# Altium schematic sheet stm32h750xbh6-sig.SchDoc: MCUB
size A4; Date: 10.4.2025; CheckedBy: BCY; DrawnBy: miaow; DocumentNumber: 7; Revision: v0.0.1; SheetNumber: 7; SheetTotal: 12; Sample: A0; Url: github.com/miaow-cn/pcb-lib; Liscense: GPLv3; Board: MIAOW FOC BOARD; BoardType: MAIN_PCB; Desc: io part of stm32h750xbh6
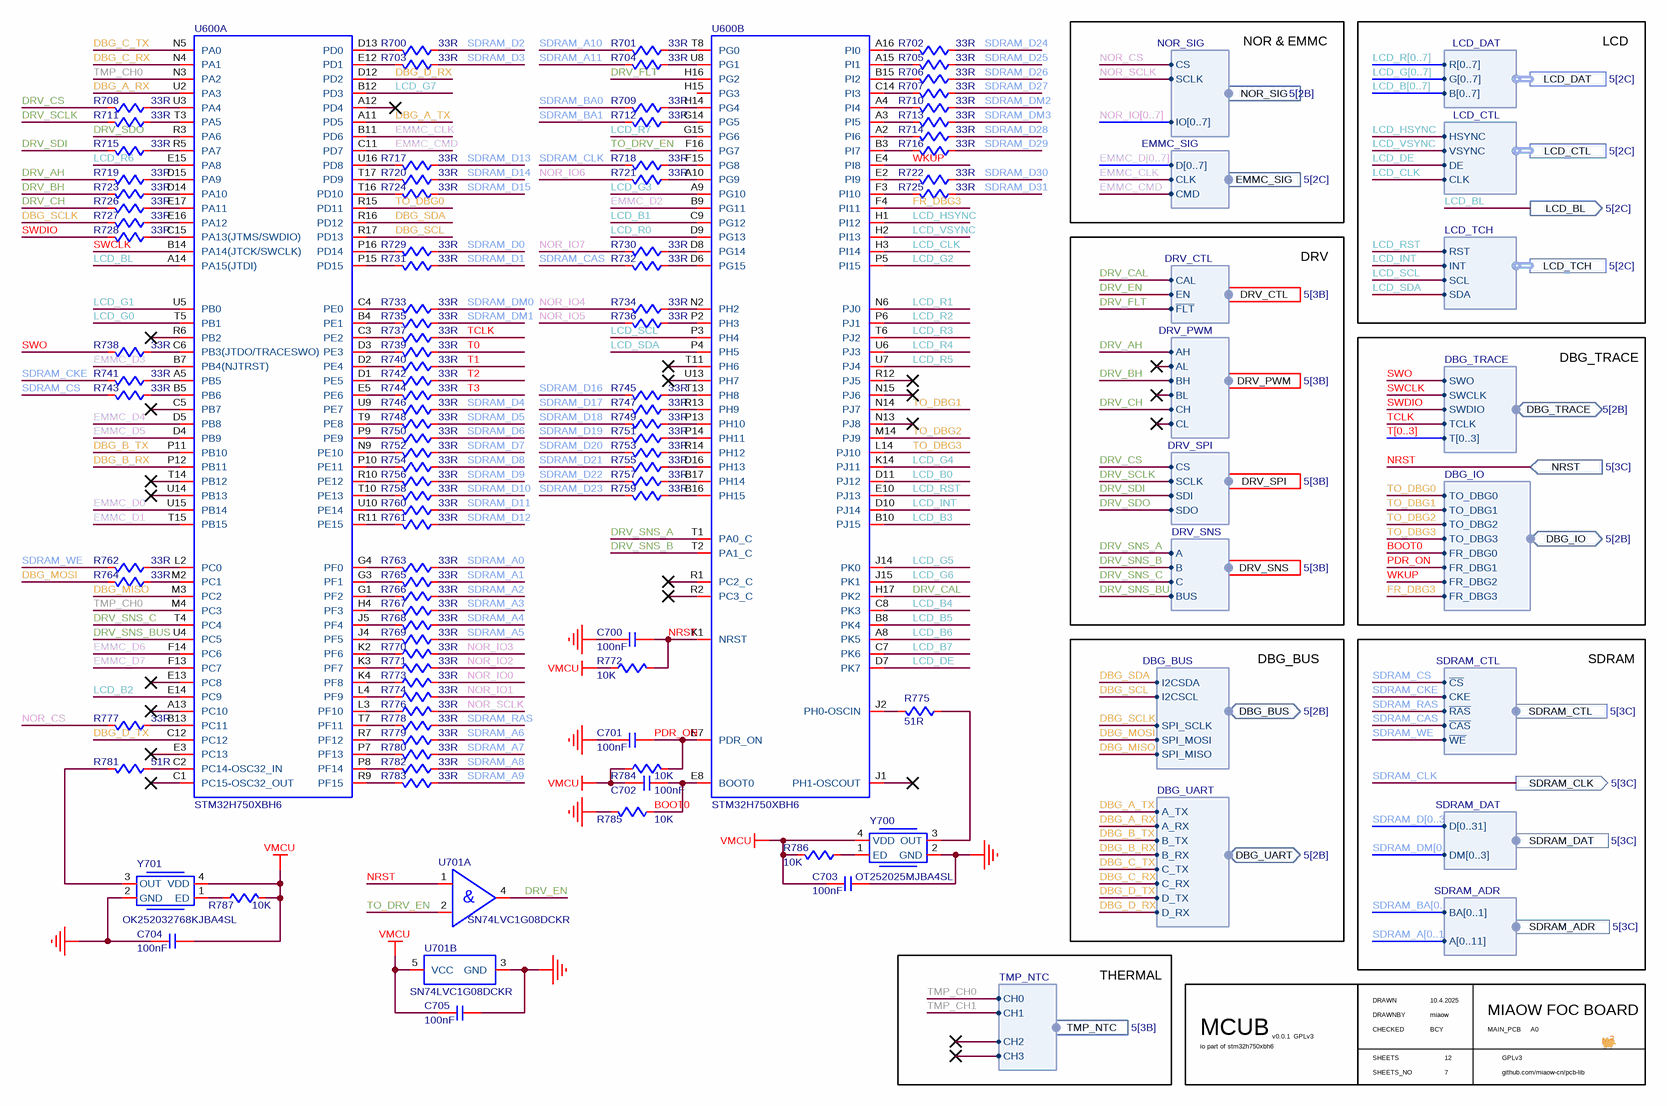
[diagram p0: stm32h750xbh6-sig.SchDoc]

## Parts
C700  value 100nF  [C0402]  (hidden comment: C-NOMO)
C701  value 100nF  [C0402]  (hidden comment: C-NOMO)
C702  value 100nF  [C0402]  (hidden comment: C-NOMO)
C703  value 100nF  [C0402]  (hidden comment: C-NOMO)
C704  value 100nF  [C0402]  (hidden comment: C-NOMO)
C705  value 100nF  [C0402]  (hidden comment: C-NOMO)
R700  value 33R  [R0402]  (hidden comment: R)
R701  value 33R  [R0402]  (hidden comment: R)
R702  value 33R  [R0402]  (hidden comment: R)
R703  value 33R  [R0402]  (hidden comment: R)
R704  value 33R  [R0402]  (hidden comment: R)
R705  value 33R  [R0402]  (hidden comment: R)
R706  value 33R  [R0402]  (hidden comment: R)
R707  value 33R  [R0402]  (hidden comment: R)
R708  value 33R  [R0402]  (hidden comment: R)
R709  value 33R  [R0402]  (hidden comment: R)
R710  value 33R  [R0402]  (hidden comment: R)
R711  value 33R  [R0402]  (hidden comment: R)
R712  value 33R  [R0402]  (hidden comment: R)
R713  value 33R  [R0402]  (hidden comment: R)
R714  value 33R  [R0402]  (hidden comment: R)
R715  value 33R  [R0402]  (hidden comment: R)
R716  value 33R  [R0402]  (hidden comment: R)
R717  value 33R  [R0402]  (hidden comment: R)
R718  value 33R  [R0402]  (hidden comment: R)
R719  value 33R  [R0402]  (hidden comment: R)
R720  value 33R  [R0402]  (hidden comment: R)
R721  value 33R  [R0402]  (hidden comment: R)
R722  value 33R  [R0402]  (hidden comment: R)
R723  value 33R  [R0402]  (hidden comment: R)
R724  value 33R  [R0402]  (hidden comment: R)
R725  value 33R  [R0402]  (hidden comment: R)
R726  value 33R  [R0402]  (hidden comment: R)
R727  value 33R  [R0402]  (hidden comment: R)
R728  value 33R  [R0402]  (hidden comment: R)
R729  value 33R  [R0402]  (hidden comment: R)
R730  value 33R  [R0402]  (hidden comment: R)
R731  value 33R  [R0402]  (hidden comment: R)
R732  value 33R  [R0402]  (hidden comment: R)
R733  value 33R  [R0402]  (hidden comment: R)
R734  value 33R  [R0402]  (hidden comment: R)
R735  value 33R  [R0402]  (hidden comment: R)
R736  value 33R  [R0402]  (hidden comment: R)
R737  value 33R  [R0402]  (hidden comment: R)
R738  value 33R  [R0402]  (hidden comment: R)
R739  value 33R  [R0402]  (hidden comment: R)
R740  value 33R  [R0402]  (hidden comment: R)
R741  value 33R  [R0402]  (hidden comment: R)
R742  value 33R  [R0402]  (hidden comment: R)
R743  value 33R  [R0402]  (hidden comment: R)
R744  value 33R  [R0402]  (hidden comment: R)
R745  value 33R  [R0402]  (hidden comment: R)
R746  value 33R  [R0402]  (hidden comment: R)
R747  value 33R  [R0402]  (hidden comment: R)
R748  value 33R  [R0402]  (hidden comment: R)
R749  value 33R  [R0402]  (hidden comment: R)
R750  value 33R  [R0402]  (hidden comment: R)
R751  value 33R  [R0402]  (hidden comment: R)
R752  value 33R  [R0402]  (hidden comment: R)
R753  value 33R  [R0402]  (hidden comment: R)
R754  value 33R  [R0402]  (hidden comment: R)
R755  value 33R  [R0402]  (hidden comment: R)
R756  value 33R  [R0402]  (hidden comment: R)
R757  value 33R  [R0402]  (hidden comment: R)
R758  value 33R  [R0402]  (hidden comment: R)
R759  value 33R  [R0402]  (hidden comment: R)
R760  value 33R  [R0402]  (hidden comment: R)
R761  value 33R  [R0402]  (hidden comment: R)
R762  value 33R  [R0402]  (hidden comment: R)
R763  value 33R  [R0402]  (hidden comment: R)
R764  value 33R  [R0402]  (hidden comment: R)
R765  value 33R  [R0402]  (hidden comment: R)
R766  value 33R  [R0402]  (hidden comment: R)
R767  value 33R  [R0402]  (hidden comment: R)
R768  value 33R  [R0402]  (hidden comment: R)
R769  value 33R  [R0402]  (hidden comment: R)
R770  value 33R  [R0402]  (hidden comment: R)
R771  value 33R  [R0402]  (hidden comment: R)
R772  value 10K  [R0402]  (hidden comment: R)
R773  value 33R  [R0402]  (hidden comment: R)
R774  value 33R  [R0402]  (hidden comment: R)
R775  value 51R  [R0402]  (hidden comment: R)
R776  value 33R  [R0402]  (hidden comment: R)
R777  value 33R  [R0402]  (hidden comment: R)
R778  value 33R  [R0402]  (hidden comment: R)
R779  value 33R  [R0402]  (hidden comment: R)
R780  value 33R  [R0402]  (hidden comment: R)
R781  value 51R  [R0402]  (hidden comment: R)
R782  value 33R  [R0402]  (hidden comment: R)
R783  value 33R  [R0402]  (hidden comment: R)
R784  value 10K  [R0402]  (hidden comment: R)
R785  value 10K  [R0402]  (hidden comment: R)
R786  value 10K  [R0402]  (hidden comment: R)
R787  value 10K  [R0402]  (hidden comment: R)
U600  STM32H750XBH6  [STM32H750XBH6]  (parts A,B of 3)
U701  SN74LVC1G08DCKR  [SN74LVC1G08DCKR]  (parts A,B of 2)
Y700  OT252025MJBA4SL  [OT252025MJBA4SL]
Y701  OK252032768KJBA4SL  [OK252032768KJBA4SL]

## Ports
DBG_BUS (bidir, harness DBG_BUS, see 5[2B]), DBG_IO (bidir, harness DBG_IO, see 5[2B]), DBG_TRACE (bidir, harness DBG_TRACE, see 5[2B]), DBG_UART (bidir, harness DBG_UART, see 5[2B]), DRV_CTL (out, harness DRV_CTL, see 5[3B]), DRV_PWM (out, harness DRV_PWM, see 5[3B]), DRV_SNS (out, harness DRV_SNS, see 5[3B]), DRV_SPI (out, harness DRV_SPI, see 5[3B]), EMMC_SIG (in, harness EMMC_SIG, see 5[2C]), LCD_BL (out, see 5[2C]), LCD_CTL (harness LCD_CTL, see 5[2C]), LCD_DAT (harness LCD_DAT, see 5[2C]), LCD_TCH (harness LCD_TCH, see 5[2C]), NOR_SIG (in, harness NOR_SIG, see 5[2B]), NRST (in, see 5[3C]), SDRAM_ADR (harness SDRAM_ADR, see 5[3C]), SDRAM_CLK (out, see 5[3C]), SDRAM_CTL (harness SDRAM_CTL, see 5[3C]), SDRAM_DAT (harness SDRAM_DAT, see 5[3C]), TMP_NTC (in, harness TMP_NTC, see 5[3B])

## Harnesses
SDRAM_DAT: DM[0..3], D[0..31]
SDRAM_ADR: BA[0..1], A[0..11]
SDRAM_CTL: ~{CS}, CKE, ~{RAS}, ~{CAS}, ~{WE}
DRV_CTL: CAL, EN, ~{FLT}
DRV_SNS: C, B, A, BUS
DRV_SPI: CS, SCLK, SDI, SDO
DRV_PWM: AH, AL, BH, BL, CH, CL
LCD_DAT: R[0..7], G[0..7], B[0..7]
LCD_CTL: HSYNC, VSYNC, DE, CLK
LCD_TCH: SDA, SCL, INT, RST
EMMC_SIG: D[0..7], CLK, CMD
NOR_SIG: CS, SCLK, IO[0..7]
DBG_UART: A_TX, A_RX, B_TX, B_RX, C_TX, C_RX, D_TX, D_RX
DBG_BUS: I2CSDA, I2CSCL, SPI_MISO, SPI_MOSI, SPI_SCLK
DBG_TRACE: SWO, SWCLK, SWDIO, TCLK, T[0..3]
DBG_IO: TO_DBG0, TO_DBG1, FR_DBG0, TO_DBG3, TO_DBG2, FR_DBG1, FR_DBG2, FR_DBG3
TMP_NTC: CH0, CH1, CH2, CH3

## Nets
GND: C700.2 C701.2 C703.2 C704.2 C705.2 R785.1 U701.3(GND) Y700.2(GND) Y701.2(GND)
VMCU: C702.2 C703.1 C704.1 C705.1 R772.1 R784.2 R786.1 R787.1 U701.5(VCC) Y700.4(VDD) Y701.4(VDD)
BOOT0: C702.1 R785.2 U600.E8(BOOT0) ; port DBG_IO.FR_DBG0
DBG_A_RX: U600.U2(PA3) ; port DBG_UART.A_RX
DBG_A_TX: U600.A11(PD5) ; port DBG_UART.A_TX
DBG_B_RX: U600.P12(PB11) ; port DBG_UART.B_RX
DBG_B_TX: U600.P11(PB10) ; port DBG_UART.B_TX
DBG_C_RX: U600.N4(PA1) ; port DBG_UART.C_RX
DBG_C_TX: U600.N5(PA0) ; port DBG_UART.C_TX
DBG_D_RX: U600.D12(PD2) ; port DBG_UART.D_RX
DBG_D_TX: U600.C12(PC12) ; port DBG_UART.D_TX
DBG_MISO: U600.M3(PC2) ; port DBG_BUS.SPI_MISO
DBG_MOSI: R764.2 ; port DBG_BUS.SPI_MOSI
DBG_SCL: U600.R17(PD13) ; port DBG_BUS.I2CSCL
DBG_SCLK: R727.2 ; port DBG_BUS.SPI_SCLK
DBG_SDA: U600.R16(PD12) ; port DBG_BUS.I2CSDA
DRV_AH: R719.2 ; port DRV_PWM.AH
DRV_BH: R723.2 ; port DRV_PWM.BH
DRV_CAL: U600.H17(PK2) ; port DRV_CTL.CAL
DRV_CH: R726.2 ; port DRV_PWM.CH
DRV_CS: R708.2 ; port DRV_SPI.CS
DRV_EN: U701.4(Y) ; port DRV_CTL.EN
DRV_FLT: U600.H16(PG2) ; port DRV_CTL.~{FLT}
DRV_SCLK: R711.2 ; port DRV_SPI.SCLK
DRV_SDI: R715.2 ; port DRV_SPI.SDI
DRV_SDO: U600.R3(PA6) ; port DRV_SPI.SDO
DRV_SNS_A: U600.T1(PA0_C) ; port DRV_SNS.A
DRV_SNS_B: U600.T2(PA1_C) ; port DRV_SNS.B
DRV_SNS_BUS: U600.U4(PC5) ; port DRV_SNS.BUS
DRV_SNS_C: U600.T4(PC4) ; port DRV_SNS.C
EMMC_CLK: U600.B11(PD6) ; port EMMC_SIG.CLK
EMMC_CMD: U600.C11(PD7) ; port EMMC_SIG.CMD
EMMC_D0: U600.U15(PB14)
EMMC_D1: U600.T15(PB15)
EMMC_D2: U600.B9(PG11)
EMMC_D3: U600.B7(PB4(NJTRST))
EMMC_D4: U600.D5(PB8)
EMMC_D5: U600.D4(PB9)
EMMC_D6: U600.F14(PC6)
EMMC_D7: U600.F13(PC7)
FR_DBG3: U600.F4(PI11) ; port DBG_IO.FR_DBG3
LCD_B0: U600.D11(PJ12)
LCD_B1: U600.C9(PG12)
LCD_B2: U600.E14(PC9)
LCD_B3: U600.B10(PJ15)
LCD_B4: U600.C8(PK3)
LCD_B5: U600.B8(PK4)
LCD_B6: U600.A8(PK5)
LCD_B7: U600.C7(PK6)
LCD_BL: U600.A14(PA15(JTDI)) ; port LCD_BL
LCD_CLK: U600.H3(PI14) ; port LCD_CTL.CLK
LCD_DE: U600.D7(PK7) ; port LCD_CTL.DE
LCD_G0: U600.T5(PB1)
LCD_G1: U600.U5(PB0)
LCD_G2: U600.P5(PI15)
LCD_G3: U600.A9(PG10)
LCD_G4: U600.K14(PJ11)
LCD_G5: U600.J14(PK0)
LCD_G6: U600.J15(PK1)
LCD_G7: U600.B12(PD3)
LCD_HSYNC: U600.H1(PI12) ; port LCD_CTL.HSYNC
LCD_INT: U600.D10(PJ14) ; port LCD_TCH.INT
LCD_R0: U600.D9(PG13)
LCD_R1: U600.N6(PJ0)
LCD_R2: U600.P6(PJ1)
LCD_R3: U600.T6(PJ2)
LCD_R4: U600.U6(PJ3)
LCD_R5: U600.U7(PJ4)
LCD_R6: U600.E15(PA8)
LCD_R7: U600.G15(PG6)
LCD_RST: U600.E10(PJ13) ; port LCD_TCH.RST
LCD_SCL: U600.P3(PH4) ; port LCD_TCH.SCL
LCD_SDA: U600.P4(PH5) ; port LCD_TCH.SDA
LCD_VSYNC: U600.H2(PI13) ; port LCD_CTL.VSYNC
NOR_CS: R777.2 ; port NOR_SIG.CS
NOR_IO0: R773.2
NOR_IO1: R774.2
NOR_IO2: R771.2
NOR_IO3: R770.2
NOR_IO4: R734.2
NOR_IO5: R736.2
NOR_IO6: R721.2
NOR_IO7: R730.2
NOR_SCLK: R776.2 ; port NOR_SIG.SCLK
NRST: C700.1 R772.2 U600.K1(NRST) U701.1(A) ; port NRST
PDR_ON: C701.1 R784.1 U600.E7(PDR_ON) ; port DBG_IO.FR_DBG1
SDRAM_A0: R763.2
SDRAM_A1: R765.2
SDRAM_A2: R766.2
SDRAM_A3: R767.2
SDRAM_A4: R768.2
SDRAM_A5: R769.2
SDRAM_A6: R779.2
SDRAM_A7: R780.2
SDRAM_A8: R782.2
SDRAM_A9: R783.2
SDRAM_A10: R701.2
SDRAM_A11: R704.2
SDRAM_BA0: R709.2
SDRAM_BA1: R712.2
SDRAM_CAS: R732.2 ; port SDRAM_CTL.~{CAS}
SDRAM_CKE: R741.2 ; port SDRAM_CTL.CKE
SDRAM_CLK: R718.2 ; port SDRAM_CLK
SDRAM_CS: R743.2 ; port SDRAM_CTL.~{CS}
SDRAM_D0: R729.2
SDRAM_D1: R731.2
SDRAM_D2: R700.2
SDRAM_D3: R703.2
SDRAM_D4: R746.2
SDRAM_D5: R748.2
SDRAM_D6: R750.2
SDRAM_D7: R752.2
SDRAM_D8: R754.2
SDRAM_D9: R756.2
SDRAM_D10: R758.2
SDRAM_D11: R760.2
SDRAM_D12: R761.2
SDRAM_D13: R717.2
SDRAM_D14: R720.2
SDRAM_D15: R724.2
SDRAM_D16: R745.2
SDRAM_D17: R747.2
SDRAM_D18: R749.2
SDRAM_D19: R751.2
SDRAM_D20: R753.2
SDRAM_D21: R755.2
SDRAM_D22: R757.2
SDRAM_D23: R759.2
SDRAM_D24: R702.2
SDRAM_D25: R705.2
SDRAM_D26: R706.2
SDRAM_D27: R707.2
SDRAM_D28: R714.2
SDRAM_D29: R716.2
SDRAM_D30: R722.2
SDRAM_D31: R725.2
SDRAM_DM0: R733.2
SDRAM_DM1: R735.2
SDRAM_DM2: R710.2
SDRAM_DM3: R713.2
SDRAM_RAS: R778.2 ; port SDRAM_CTL.~{RAS}
SDRAM_WE: R762.2 ; port SDRAM_CTL.~{WE}
SWCLK: U600.B14(PA14(JTCK/SWCLK)) ; port DBG_TRACE.SWCLK
SWDIO: R728.2 ; port DBG_TRACE.SWDIO
SWO: R738.2 ; port DBG_TRACE.SWO
T0: R739.2
T1: R740.2
T2: R742.2
T3: R744.2
TCLK: R737.2 ; port DBG_TRACE.TCLK
TMP_CH0: U600.M4(PC3) U600.N3(PA2) ; port TMP_NTC.CH0
TMP_CH1: port TMP_NTC.CH1
TO_DBG0: U600.R15(PD11) ; port DBG_IO.TO_DBG0
TO_DBG1: U600.N14(PJ7) ; port DBG_IO.TO_DBG1
TO_DBG2: U600.M14(PJ9) ; port DBG_IO.TO_DBG2
TO_DBG3: U600.L14(PJ10) ; port DBG_IO.TO_DBG3
TO_DRV_EN: U600.F16(PG7) U701.2(B)
WKUP: U600.E4(PI8) ; port DBG_IO.FR_DBG2
NetR700_1: R700.1 U600.D13(PD0)
NetR701_1: R701.1 U600.T8(PG0)
NetR702_1: R702.1 U600.A16(PI0)
NetR703_1: R703.1 U600.E12(PD1)
NetR704_1: R704.1 U600.U8(PG1)
NetR705_1: R705.1 U600.A15(PI1)
NetR706_1: R706.1 U600.B15(PI2)
NetR707_1: R707.1 U600.C14(PI3)
NetR708_1: R708.1 U600.U3(PA4)
NetR709_1: R709.1 U600.H14(PG4)
NetR710_1: R710.1 U600.A4(PI4)
NetR711_1: R711.1 U600.T3(PA5)
NetR712_1: R712.1 U600.G14(PG5)
NetR713_1: R713.1 U600.A3(PI5)
NetR714_1: R714.1 U600.A2(PI6)
NetR715_1: R715.1 U600.R5(PA7)
NetR716_1: R716.1 U600.B3(PI7)
NetR717_1: R717.1 U600.U16(PD8)
NetR718_1: R718.1 U600.F15(PG8)
NetR719_1: R719.1 U600.D15(PA9)
NetR720_1: R720.1 U600.T17(PD9)
NetR721_1: R721.1 U600.A10(PG9)
NetR722_1: R722.1 U600.E2(PI9)
NetR723_1: R723.1 U600.D14(PA10)
NetR724_1: R724.1 U600.T16(PD10)
NetR725_1: R725.1 U600.F3(PI10)
NetR726_1: R726.1 U600.E17(PA11)
NetR727_1: R727.1 U600.E16(PA12)
NetR728_1: R728.1 U600.C15(PA13(JTMS/SWDIO))
NetR729_1: R729.1 U600.P16(PD14)
NetR730_1: R730.1 U600.D8(PG14)
NetR731_1: R731.1 U600.P15(PD15)
NetR732_1: R732.1 U600.D6(PG15)
NetR733_1: R733.1 U600.C4(PE0)
NetR734_1: R734.1 U600.N2(PH2)
NetR735_1: R735.1 U600.B4(PE1)
NetR736_1: R736.1 U600.P2(PH3)
NetR737_1: R737.1 U600.C3(PE2)
NetR738_1: R738.1 U600.C6(PB3(JTDO/TRACESWO))
NetR739_1: R739.1 U600.D3(PE3)
NetR740_1: R740.1 U600.D2(PE4)
NetR741_1: R741.1 U600.A5(PB5)
NetR742_1: R742.1 U600.D1(PE5)
NetR743_1: R743.1 U600.B5(PB6)
NetR744_1: R744.1 U600.E5(PE6)
NetR745_1: R745.1 U600.T13(PH8)
NetR746_1: R746.1 U600.U9(PE7)
NetR747_1: R747.1 U600.R13(PH9)
NetR748_1: R748.1 U600.T9(PE8)
NetR749_1: R749.1 U600.P13(PH10)
NetR750_1: R750.1 U600.P9(PE9)
NetR751_1: R751.1 U600.P14(PH11)
NetR752_1: R752.1 U600.N9(PE10)
NetR753_1: R753.1 U600.R14(PH12)
NetR754_1: R754.1 U600.P10(PE11)
NetR755_1: R755.1 U600.D16(PH13)
NetR756_1: R756.1 U600.R10(PE12)
NetR757_1: R757.1 U600.B17(PH14)
NetR758_1: R758.1 U600.T10(PE13)
NetR759_1: R759.1 U600.B16(PH15)
NetR760_1: R760.1 U600.U10(PE14)
NetR761_1: R761.1 U600.R11(PE15)
NetR762_1: R762.1 U600.L2(PC0)
NetR763_1: R763.1 U600.G4(PF0)
NetR764_1: R764.1 U600.M2(PC1)
NetR765_1: R765.1 U600.G3(PF1)
NetR766_1: R766.1 U600.G1(PF2)
NetR767_1: R767.1 U600.H4(PF3)
NetR768_1: R768.1 U600.J5(PF4)
NetR769_1: R769.1 U600.J4(PF5)
NetR770_1: R770.1 U600.K2(PF6)
NetR771_1: R771.1 U600.K3(PF7)
NetR773_1: R773.1 U600.K4(PF8)
NetR774_1: R774.1 U600.L4(PF9)
NetR775_1: R775.1 U600.J2(PH0-OSCIN)
NetR775_2: R775.2 Y700.3(OUT)
NetR776_1: R776.1 U600.L3(PF10)
NetR777_1: R777.1 U600.B13(PC11)
NetR778_1: R778.1 U600.T7(PF11)
NetR779_1: R779.1 U600.R7(PF12)
NetR780_1: R780.1 U600.P7(PF13)
NetR781_1: R781.1 Y701.3(OUT)
NetR781_2: R781.2 U600.C2(PC14-OSC32_IN)
NetR782_1: R782.1 U600.P8(PF14)
NetR783_1: R783.1 U600.R9(PF15)
NetR786_2: R786.2 Y700.1(ED)
NetR787_2: R787.2 Y701.1(ED)

Not connected (* = marked no-connect by the designer): U600 A12(PD4)* A13(PC10)* C1(PC15-OSC32_OUT)* C5(PB7)* E3(PC13)* E13(PC8)* H15(PG3) J1(PH1-OSCOUT)* N13(PJ8)* N15(PJ6)* R1(PC2_C)* R2(PC3_C)* R6(PB2)* R12(PJ5)* T11(PH6)* T14(PB12)* U13(PH7)* U14(PB13)*

## Buses and harness runs
bus EMMC_D[0..7]
bus LCD_B[0..7]
bus LCD_G[0..7]
bus LCD_R[0..7]
bus NOR_IO[0..7]
bus SDRAM_A[0..11]
bus SDRAM_BA[0..1]
bus SDRAM_D[0..31]
bus SDRAM_DM[0..3]
bus T[0..3]

## Notes on the sheet
- NOR & EMMC
- LCD
- DRV
- DBG_TRACE
- DBG_BUS
- SDRAM
- THERMAL
- DRAWN
- CHECKED
- DRAWNBY
- SHEETS
- SHEETS_NO
- (in symbol SN74LVC1G08DCKR, part A) &

## Library data of the parts
C700-C705 = C-NOMO: voltage: 25V; precision: 5%
R700-R787 = R: precision: 1%
U600 = STM32H750XBH6: MCU; Supplier 1: LCSC; Supplier Part Number 1: C405932
U701 = SN74LVC1G08DCKR: AND GATE  - 1bit; Supplier 1: LCSC; Supplier Part Number 1: C7832
Y700 = OT252025MJBA4SL: value: 25MHz; Supplier 1: LCSC; Supplier Part Number 1: C717683
Y701 = OK252032768KJBA4SL: value: 32.768KHz; Supplier 1: LCSC; Supplier Part Number 1: C669098